# EAGLE design btmodbreakout (EAGLE 7.2.0)
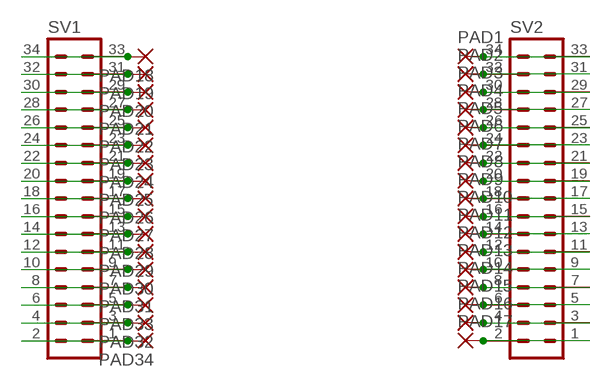
[diagram p0: schematic, sheet 1]

## Parts
PAD1  SMD2  [SMD1,27-2,54]
PAD2  SMD2  [SMD1,27-2,54]
PAD3  SMD2  [SMD1,27-2,54]
PAD4  SMD2  [SMD1,27-2,54]
PAD5  SMD2  [SMD1,27-2,54]
PAD6  SMD2  [SMD1,27-2,54]
PAD7  SMD2  [SMD1,27-2,54]
PAD8  SMD2  [SMD1,27-2,54]
PAD9  SMD2  [SMD1,27-2,54]
PAD10  SMD2  [SMD1,27-2,54]
PAD11  SMD2  [SMD1,27-2,54]
PAD12  SMD2  [SMD1,27-2,54]
PAD13  SMD2  [SMD1,27-2,54]
PAD14  SMD2  [SMD1,27-2,54]
PAD15  SMD2  [SMD1,27-2,54]
PAD16  SMD2  [SMD1,27-2,54]
PAD17  SMD2  [SMD1,27-2,54]
PAD18  SMD2  [SMD1,27-2,54]
PAD19  SMD2  [SMD1,27-2,54]
PAD20  SMD2  [SMD1,27-2,54]
PAD21  SMD2  [SMD1,27-2,54]
PAD22  SMD2  [SMD1,27-2,54]
PAD23  SMD2  [SMD1,27-2,54]
PAD24  SMD2  [SMD1,27-2,54]
PAD25  SMD2  [SMD1,27-2,54]
PAD26  SMD2  [SMD1,27-2,54]
PAD27  SMD2  [SMD1,27-2,54]
PAD28  SMD2  [SMD1,27-2,54]
PAD29  SMD2  [SMD1,27-2,54]
PAD30  SMD2  [SMD1,27-2,54]
PAD31  SMD2  [SMD1,27-2,54]
PAD32  SMD2  [SMD1,27-2,54]
PAD33  SMD2  [SMD1,27-2,54]
PAD34  SMD2  [SMD1,27-2,54]
SV1  MA17-2  [MA17-2]
SV2  MA17-2  [MA17-2]

## Nets
N$1: PAD18.1(P) SV1.33 SV1.34
N$2: PAD19.1(P) SV1.31 SV1.32
N$3: PAD20.1(P) SV1.29 SV1.30
N$4: PAD21.1(P) SV1.27 SV1.28
N$5: PAD22.1(P) SV1.25 SV1.26
N$6: PAD23.1(P) SV1.23 SV1.24
N$7: PAD24.1(P) SV1.21 SV1.22
N$8: PAD25.1(P) SV1.19 SV1.20
N$9: PAD26.1(P) SV1.17 SV1.18
N$10: PAD27.1(P) SV1.15 SV1.16
N$11: PAD28.1(P) SV1.13 SV1.14
N$12: PAD29.1(P) SV1.11 SV1.12
N$13: PAD30.1(P) SV1.9 SV1.10
N$14: PAD31.1(P) SV1.7 SV1.8
N$15: PAD33.1(P) SV1.5 SV1.6
N$16: PAD32.1(P) SV1.3 SV1.4
N$17: PAD34.1(P) SV1.1 SV1.2
N$18: PAD1.1(P) SV2.33 SV2.34
N$19: PAD2.1(P) SV2.31 SV2.32
N$20: PAD3.1(P) SV2.29 SV2.30
N$21: PAD4.1(P) SV2.27 SV2.28
N$22: PAD5.1(P) SV2.25 SV2.26
N$23: PAD6.1(P) SV2.23 SV2.24
N$24: PAD7.1(P) SV2.21 SV2.22
N$25: PAD8.1(P) SV2.19 SV2.20
N$26: PAD9.1(P) SV2.17 SV2.18
N$27: PAD10.1(P) SV2.15 SV2.16
N$28: PAD11.1(P) SV2.13 SV2.14
N$29: PAD12.1(P) SV2.11 SV2.12
N$30: PAD13.1(P) SV2.9 SV2.10
N$31: PAD14.1(P) SV2.7 SV2.8
N$32: PAD15.1(P) SV2.5 SV2.6
N$33: PAD16.1(P) SV2.3 SV2.4
N$34: PAD17.1(P) SV2.1 SV2.2

## Library data of the parts
PAD1-PAD34 = wirepad:SMD2: SMD PAD
SV1 SV2 = con-lstb:MA17-2: PIN HEADER; OC_FARNELL: unknown; OC_NEWARK: unknown

## Board
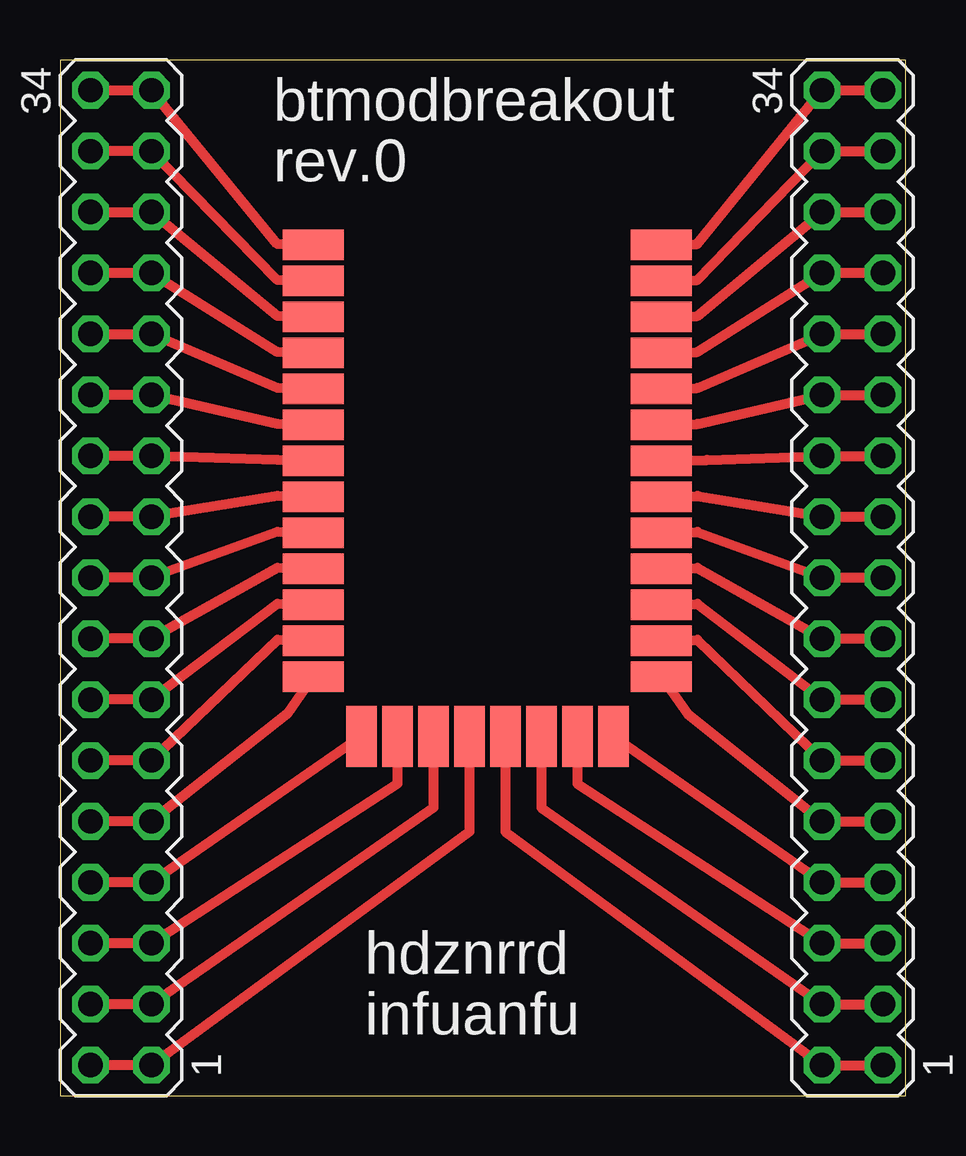
[diagram p1: board, top side]

Size 35.23 x 43.17 mm. Coordinates in mm from the lower left corner, seen from the top.
Outline: 0,0 35.23,0 35.23,43.17 0,43.17 0,0
Copper layers (1*16): Top 0.035mm / dielectric 1.5mm / Bottom 0.035mm
Design rules "default": minimum track width 10mil, minimum drill 24mil, track to track 8mil, track to pad 8mil, pad to pad 8mil, via to via 8mil, smd to smd 8mil, copper to edge 40mil, drill to drill 8mil, minimum pad ring 10mil, minimum via ring 8mil, stop-mask expansion 4mil, vias tented up to drill 0mil, thermal gap 10mil

### Footprints (pad centres in the part's own frame; a part is rotated, then mirrored left to right if it is on the bottom)
SMD1,27-2,54 = smd 1.27 x 2.54: 1 0,0
MA17-2 = drill 1.016 octagon: 1 -20.32,-1.27; 2 -20.32,1.27; 3 -17.78,-1.27; 4 -17.78,1.27; 5 -15.24,-1.27; 6 -15.24,1.27; 7 -12.7,-1.27; 8 -12.7,1.27; 9 -10.16,-1.27; 10 -10.16,1.27; 11 -7.62,-1.27; 12 -7.62,1.27; 13 -5.08,-1.27; 14 -5.08,1.27; 15 -2.54,-1.27; 16 -2.54,1.27; 17 0,-1.27; 18 0,1.27; 19 2.54,-1.27; 20 2.54,1.27; 21 5.08,-1.27; 22 5.08,1.27; 23 7.62,-1.27; 24 7.62,1.27; 25 10.16,-1.27; 26 10.16,1.27; 27 12.7,-1.27; 28 12.7,1.27; 29 15.24,-1.27; 30 15.24,1.27; 31 17.78,-1.27; 32 17.78,1.27; 33 20.32,-1.27; 34 20.32,1.27

### Placement (x,y rotation side)
PAD1  10.56,35.47 90 top
PAD2  10.56,33.97 90 top
PAD3  10.56,32.47 90 top
PAD4  10.56,30.97 90 top
PAD5  10.56,29.47 90 top
PAD6  10.56,27.97 90 top
PAD7  10.56,26.47 90 top
PAD8  10.56,24.97 90 top
PAD9  10.56,23.47 90 top
PAD10  10.56,21.97 90 top
PAD11  10.56,20.47 90 top
PAD12  10.56,18.97 90 top
PAD13  10.56,17.47 90 top
PAD14  12.56,14.97 180 top
PAD15  14.06,14.97 0 top
PAD16  15.56,14.97 0 top
PAD17  17.06,14.97 0 top
PAD18  25.06,35.47 90 top
PAD19  25.06,33.97 90 top
PAD20  25.06,32.47 90 top
PAD21  25.06,30.97 90 top
PAD22  25.06,29.47 90 top
PAD23  25.06,27.97 90 top
PAD24  25.06,26.47 90 top
PAD25  25.06,24.97 90 top
PAD26  25.06,23.47 90 top
PAD27  25.06,21.97 90 top
PAD28  25.06,20.47 90 top
PAD29  25.06,18.97 90 top
PAD30  25.06,17.47 90 top
PAD31  23.06,14.97 0 top
PAD32  20.06,14.97 0 top
PAD33  21.56,14.97 0 top
PAD34  18.56,14.97 0 top
SV1  33.02,21.59 90 top
SV2  2.54,21.59 90 top

### Tracks (layer width: path | path; a pad name or v marks a point on that pad's centre or on a via)
N$1
  Top 0.406: PAD18.1 26.56,35.5 SV1.34 SV1.33
N$2
  Top 0.406: PAD19.1 26.56,34 SV1.32 SV1.31
N$3
  Top 0.406: PAD20.1 26.56,32.5 SV1.30 SV1.29
N$4
  Top 0.406: PAD21.1 26.56,31 SV1.28 SV1.27
N$5
  Top 0.406: PAD22.1 26.56,29.5 SV1.26 SV1.25
N$6
  Top 0.406: PAD23.1 26.56,28 SV1.24 SV1.23
N$7
  Top 0.406: PAD24.1 26.96,26.5 SV1.22 SV1.21
N$8
  Top 0.406: SV1.19 SV1.20 26.56,25 PAD25.1
N$9
  Top 0.406: SV1.17 SV1.18 26.56,23.5 PAD26.1
N$10
  Top 0.406: SV1.15 SV1.16 26.56,22 PAD27.1
N$11
  Top 0.406: SV1.13 SV1.14 26.56,20.5 PAD28.1
N$12
  Top 0.406: SV1.11 SV1.12 26.56,19 PAD29.1
N$13
  Top 0.406: SV1.9 SV1.10 26.16,15.9 PAD30.1
N$14
  Top 0.406: SV1.7 SV1.8 PAD31.1
N$15
  Top 0.406: SV1.5 SV1.6 21.56,13 PAD33.1
N$16
  Top 0.406: SV1.3 SV1.4 20.06,12 PAD32.1
N$17
  Top 0.406: SV1.1 SV1.2 18.56,11 PAD34.1
N$18
  Top 0.406: PAD1.1 9.49,35.47 9.06,35.5 SV2.33 SV2.34
N$19
  Top 0.406: PAD2.1 9.06,34 SV2.31 SV2.32
N$20
  Top 0.406: PAD3.1 9.06,32.5 SV2.29 SV2.30
N$21
  Top 0.406: PAD4.1 9.06,31 SV2.27 SV2.28
N$22
  Top 0.406: PAD5.1 9.06,29.5 SV2.25 SV2.26
N$23
  Top 0.406: PAD6.1 9.06,28 SV2.23 SV2.24
N$24
  Top 0.406: SV2.22 SV2.21 9.06,26.5 PAD7.1
N$25
  Top 0.406: SV2.20 SV2.19 9.06,25 PAD8.1
N$26
  Top 0.406: SV2.18 SV2.17 9.06,23.5 PAD9.1
N$27
  Top 0.406: SV2.16 SV2.15 9.06,22 PAD10.1
N$28
  Top 0.406: SV2.14 SV2.13 9.06,20.5 PAD11.1
N$29
  Top 0.406: SV2.12 SV2.11 9.06,19 PAD12.1
N$30
  Top 0.406: SV2.10 SV2.9 9.46,15.9 PAD13.1
N$31
  Top 0.406: SV2.8 SV2.7 PAD14.1
N$32
  Top 0.406: SV2.6 SV2.5 14.06,13 PAD15.1
N$33
  Top 0.406: SV2.4 SV2.3 15.56,12 PAD16.1
N$34
  Top 0.406: SV2.2 SV2.1 17.06,11 PAD17.1

### Text on the board
tNames: btmodbreakout | rev.0 | hdznrrd | infuanfu